# Altium project Mainboard_Jordan.PrjPcb
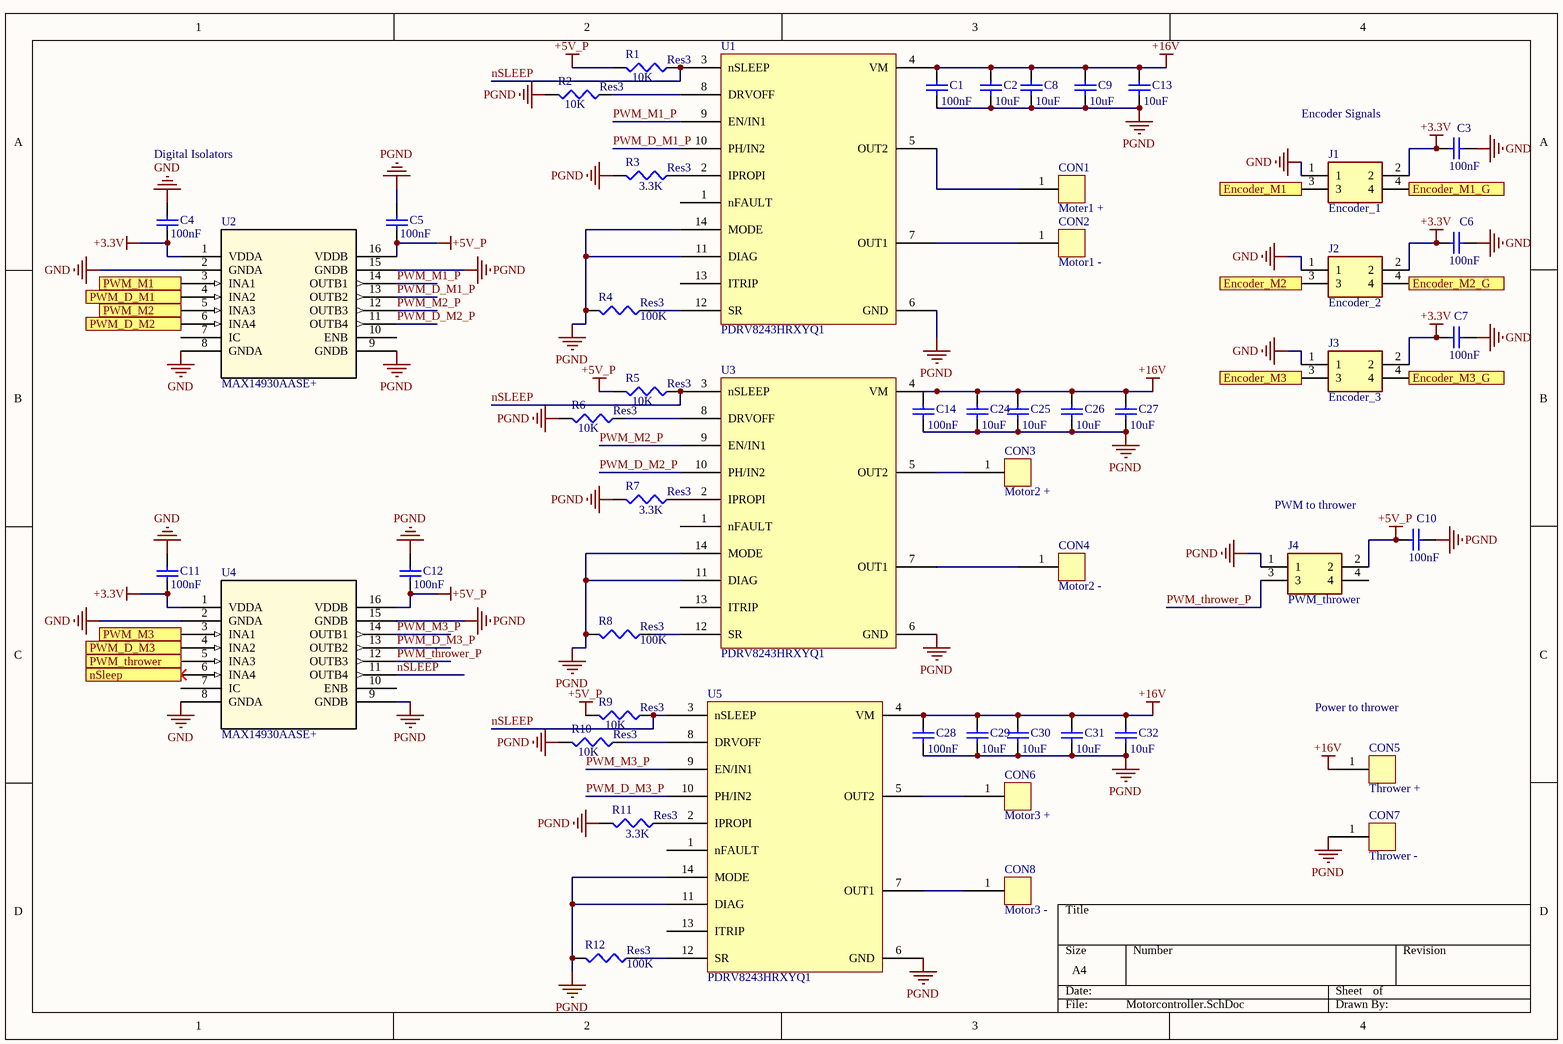
[diagram p0: Motorcontroller.SchDoc]
2 sheets, 82 parts. Net scope: flat (ports and power ports of the same name join across sheets).
Board file: PCB1.PcbDoc
Sheets:
  Motorcontroller.SchDoc
  Mainboard.SchDoc

## Sheet Motorcontroller.SchDoc
size A4; SheetNumber: 1; SheetTotal: 2

### Parts
C1  value 100nF  [1608[0603]]  (hidden comment: Cap Semi)
C2  value 10uF  [C1206]  (hidden comment: Cap Semi)
C3  value 100nF  [1608[0603]]  (hidden comment: Cap Semi)
C4  value 100nF  [1608[0603]]  (hidden comment: Cap Semi)
C5  value 100nF  [1608[0603]]  (hidden comment: Cap Semi)
C6  value 100nF  [1608[0603]]  (hidden comment: Cap Semi)
C7  value 100nF  [1608[0603]]  (hidden comment: Cap Semi)
C8  value 10uF  [C1206]  (hidden comment: Cap Semi)
C9  value 10uF  [C1206]  (hidden comment: Cap Semi)
C10  value 100nF  [1608[0603]]  (hidden comment: Cap Semi)
C11  value 100nF  [1608[0603]]  (hidden comment: Cap Semi)
C12  value 100nF  [1608[0603]]  (hidden comment: Cap Semi)
C13  value 10uF  [C1206]  (hidden comment: Cap Semi)
C14  value 100nF  [1608[0603]]  (hidden comment: Cap Semi)
C24  value 10uF  [C1206]  (hidden comment: Cap Semi)
C25  value 10uF  [C1206]  (hidden comment: Cap Semi)
C26  value 10uF  [C1206]  (hidden comment: Cap Semi)
C27  value 10uF  [C1206]  (hidden comment: Cap Semi)
C28  value 100nF  [1608[0603]]  (hidden comment: Cap Semi)
C29  value 10uF  [C1206]  (hidden comment: Cap Semi)
C30  value 10uF  [C1206]  (hidden comment: Cap Semi)
C31  value 10uF  [C1206]  (hidden comment: Cap Semi)
C32  value 10uF  [C1206]  (hidden comment: Cap Semi)
CON1  Moter1 +  [con_soldering]
CON2  Motor1 -  [con_soldering]
CON3  Motor2 +  [con_soldering]
CON4  Motor2 -  [con_soldering]
CON5  Thrower +  [con_soldering]
CON6  Motor3 +  [con_soldering]
CON7  Thrower -  [con_soldering]
CON8  Motor3 -  [con_soldering]
J1  Encoder_1  [TE_7-215079-4]
J2  Encoder_2  [TE_7-215079-4]
J3  Encoder_3  [TE_7-215079-4]
J4  PWM_thrower  [TE_7-215079-4]
R1  Res3  value 10K  [J1-0603]
R2  Res3  value 10K  [J1-0603]
R3  Res3  value 3.3K  [J1-0603]
R4  Res3  value 100K  [J1-0603]
R5  Res3  value 10K  [J1-0603]
R6  Res3  value 10K  [J1-0603]
R7  Res3  value 3.3K  [J1-0603]
R8  Res3  value 100K  [J1-0603]
R9  Res3  value 10K  [J1-0603]
R10  Res3  value 10K  [J1-0603]
R11  Res3  value 3.3K  [J1-0603]
R12  Res3  value 100K  [J1-0603]
U1  PDRV8243HRXYQ1  [DRV8243_motor_driver]
U2  MAX14930AASE+  [21-0041_S16+1_MXM]
U3  PDRV8243HRXYQ1  [DRV8243_motor_driver]
U4  MAX14930AASE+  [21-0041_S16+1_MXM]
U5  PDRV8243HRXYQ1  [DRV8243_motor_driver]

### Ports
Encoder_M1 (out), Encoder_M1_G (out), Encoder_M2 (out), Encoder_M2_G (out), Encoder_M3 (out), Encoder_M3_G (out), nSleep (in), PWM_D_M1 (in), PWM_D_M2 (in), PWM_D_M3 (in), PWM_M1 (in), PWM_M2 (in), PWM_M3 (in), PWM_thrower (in)

### Nets
+3.3V: C3.2 C4.2 C6.2 C7.2 C11.2 J1.2 J2.2 J3.2 U2.1(VDDA) U4.1(VDDA)
+5V_P: C5.2 C10.2 C12.2 J4.2 R1.2 R5.2 R9.2 U2.16(VDDB) U4.16(VDDB)
+16V: C1.2 C2.2 C8.2 C9.2 C13.2 C14.2 C24.2 C25.2 C26.2 C27.2 C28.2 C29.2 C30.2 C31.2 C32.2 CON5.1 U1.4(VM) U3.4(VM) U5.4(VM)
GND: C3.1 C4.1 C6.1 C7.1 C11.1 J1.1 J2.1 J3.1 U2.2(GNDA) U2.8(GNDA) U4.2(GNDA) U4.8(GNDA)
PGND: C1.1 C2.1 C5.1 C8.1 C9.1 C10.1 C12.1 C13.1 C14.1 C24.1 C25.1 C26.1 C27.1 C28.1 C29.1 C30.1 C31.1 C32.1 CON7.1 J4.1 R2.2 R3.2 R4.2 R6.2 R7.2 R8.2 R10.2 R11.2 R12.2 U1.6(GND) U1.11(DIAG) U1.14(MODE) U2.9(GNDB) U2.15(GNDB) U3.6(GND) U3.11(DIAG) U3.14(MODE) U4.9(GNDB) U4.15(GNDB) U5.6(GND) U5.11(DIAG) U5.14(MODE)
nSLEEP: R1.1 R5.1 R9.1 U1.3(nSLEEP) U3.3(nSLEEP) U4.11(OUTB4) U5.3(nSLEEP)
PWM_D_M1_P: U1.10(PH/IN2) U2.13(OUTB2)
PWM_D_M2_P: U2.11(OUTB4) U3.10(PH/IN2)
PWM_D_M3_P: U4.13(OUTB2) U5.10(PH/IN2)
PWM_M1_P: U1.9(EN/IN1) U2.14(OUTB1)
PWM_M2_P: U2.12(OUTB3) U3.9(EN/IN1)
PWM_M3_P: U4.14(OUTB1) U5.9(EN/IN1)
PWM_thrower_P: J4.3 U4.12(OUTB3)
NetCON1_1: CON1.1 U1.5(OUT2)
NetCON2_1: CON2.1 U1.7(OUT1)
NetCON3_1: CON3.1 U3.5(OUT2)
NetCON4_1: CON4.1 U3.7(OUT1)
NetCON6_1: CON6.1 U5.5(OUT2)
NetCON8_1: CON8.1 U5.7(OUT1)
NetJ1_3: J1.3 ; port Encoder_M1
NetJ1_4: J1.4 ; port Encoder_M1_G
NetJ2_3: J2.3 ; port Encoder_M2
NetJ2_4: J2.4 ; port Encoder_M2_G
NetJ3_3: J3.3 ; port Encoder_M3
NetJ3_4: J3.4 ; port Encoder_M3_G
NetR2_1: R2.1 U1.8(DRVOFF)
NetR3_1: R3.1 U1.2(IPROPI)
NetR4_1: R4.1 U1.12(SR)
NetR6_1: R6.1 U3.8(DRVOFF)
NetR7_1: R7.1 U3.2(IPROPI)
NetR8_1: R8.1 U3.12(SR)
NetR10_1: R10.1 U5.8(DRVOFF)
NetR11_1: R11.1 U5.2(IPROPI)
NetR12_1: R12.1 U5.12(SR)
NetU2_3: U2.3(INA1) ; port PWM_M1
NetU2_4: U2.4(INA2) ; port PWM_D_M1
NetU2_5: U2.5(INA3) ; port PWM_M2
NetU2_6: U2.6(INA4) ; port PWM_D_M2
NetU4_3: U4.3(INA1) ; port PWM_M3
NetU4_4: U4.4(INA2) ; port PWM_D_M3
NetU4_5: U4.5(INA3) ; port PWM_thrower
NetU4_6: U4.6(INA4) ; port nSleep

Not connected (* = marked no-connect by the designer): J4 4; U1 1(nFAULT) 13(ITRIP); U2 7(IC) 10(ENB); U3 1(nFAULT) 13(ITRIP); U4 7(IC) 10(ENB); U5 1(nFAULT) 13(ITRIP)

### Notes on the sheet
- Encoder Signals
- Digital Isolators
- PWM to thrower
- Power to thrower

### Library data of the parts
C1-C14 C24-C32 = Cap Semi: Capacitor (Semiconductor SIM Model)
CON1-CON8 = Con_soldering
J1-J4 = Con_4_encoder: Micro-MaTch 4 Position 1.27 mm Pitch Vertical Female-on-Board Connector; MP: 7-215079-4; MF: TE Connectivity
R1-R12 = Res3: Resistor; Published: 8-Jun-2000; LatestRevisionDate: 29-May-2009; LatestRevisionNote: IPC-7351 Footprint Added.; PackageReference: J1-0603; Publisher: Altium Limited; PackageDescription: Chip Resistor
U2 U4 = MAX14930AASE+: No Description Available; Mfr_Name: Maxim Integrated Products; Copyright: Copyright (C) 2021 Ultra Librarian. All rights reserved.; Manufacturer_Part_Number: MAX14930AASE+; RefDes: RefDes; Type: DEV

## Sheet Mainboard.SchDoc
size A4; SheetNumber: 2; SheetTotal: 2
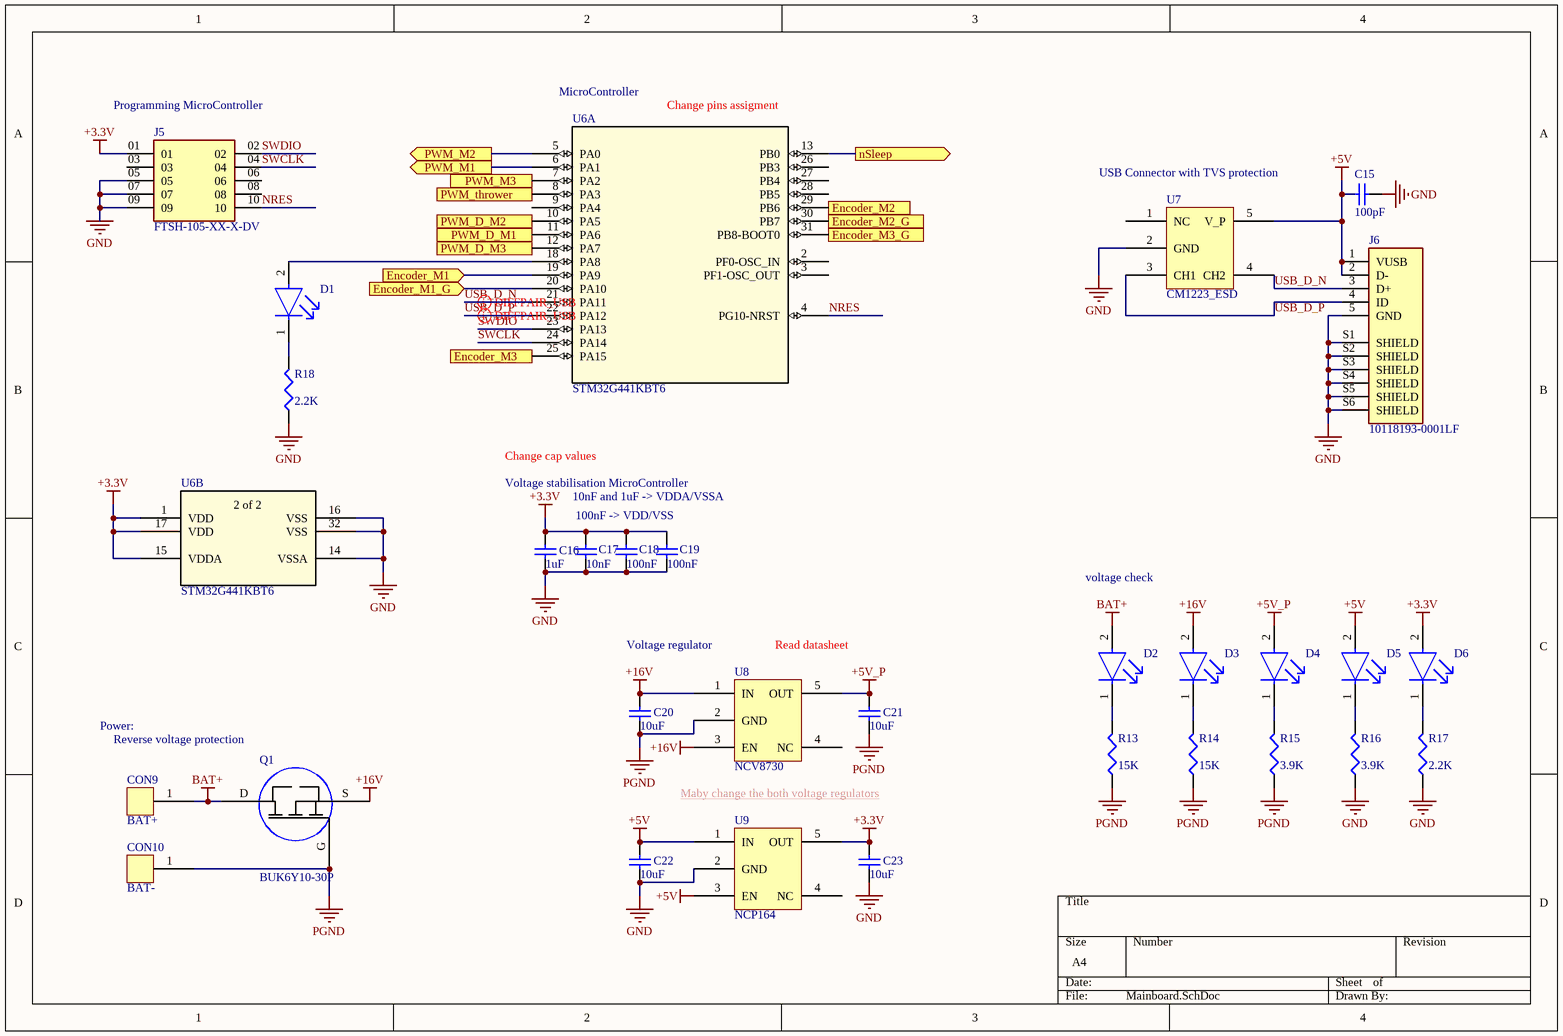
[diagram p1: Mainboard.SchDoc]

### Parts
C15  value 100pF  [1608[0603]]  (hidden comment: Cap Semi)
C16  value 1uF  [1608[0603]]  (hidden comment: Cap Semi)
C17  value 10nF  [1608[0603]]  (hidden comment: Cap Semi)
C18  value 100nF  [1608[0603]]  (hidden comment: Cap Semi)
C19  value 100nF  [1608[0603]]  (hidden comment: Cap Semi)
C20  value 10uF  [C1206]  (hidden comment: Cap Semi)
C21  value 10uF  [C1206]  (hidden comment: Cap Semi)
C22  value 10uF  [C1206]  (hidden comment: Cap Semi)
C23  value 10uF  [C1206]  (hidden comment: Cap Semi)
CON9  BAT+  [con_soldering]
CON10  BAT-  [con_soldering]
D1  LTST-C190GKT  [FP-LTST-C190GKT-MFG]  (value not drawn)
D2  LTST-C190GKT  [FP-LTST-C190GKT-MFG]  (value not drawn)
D3  LTST-C190GKT  [FP-LTST-C190GKT-MFG]  (value not drawn)
D4  LTST-C190GKT  [FP-LTST-C190GKT-MFG]  (value not drawn)
D5  LTST-C190GKT  [FP-LTST-C190GKT-MFG]  (value not drawn)
D6  LTST-C190GKT  [FP-LTST-C190GKT-MFG]  (value not drawn)
J5  FTSH-105-XX-X-DV  [SAMTEC_FTSH-105-XX-X-DV]
J6  10118193-0001LF  [FCI_10118193-0001LF]
Q1  BUK6Y10-30P  [TRANS_PSMN5R5-60YS,115]
R13  value 15K  [J1-0603]  (hidden comment: Res3)
R14  value 15K  [J1-0603]  (hidden comment: Res3)
R15  value 3.9K  [J1-0603]  (hidden comment: Res3)
R16  value 3.9K  [J1-0603]  (hidden comment: Res3)
R17  value 2.2K  [J1-0603]  (hidden comment: Res3)
R18  value 2.2K  [J1-0603]  (hidden comment: Res3)
U6  STM32G441KBT6  [LQFP-32]  (parts A,B of 2)
U7  CM1223_ESD  [CM1223_ESD]
U8  NCV8730  [NCP164CSN330T1G_Voltage_regulator]
U9  NCP164  [NCP164CSN330T1G_Voltage_regulator]

### Ports
Encoder_M1 (in), Encoder_M1_G (in), Encoder_M2 (in), Encoder_M2_G (in), Encoder_M3 (in), Encoder_M3_G (in), nSleep (out), PWM_D_M1 (out), PWM_D_M2 (out), PWM_D_M3 (out), PWM_M1 (out), PWM_M2 (out), PWM_M3 (out), PWM_thrower (out)

### Nets
+3.3V: C16.2 C17.2 C18.2 C19.2 C23.2 D6.2(A) J5.01 U6.1(VDD) U6.15(VDDA) U6.17(VDD) U9.5(OUT)
+5V: C15.2 C22.2 D5.2(A) J6.1(VUSB) J6.2(D-) U7.5(V_P) U9.1(IN) U9.3(EN)
+5V_P: C21.2 D4.2(A) U8.5(OUT)
+16V: C20.2 D3.2(A) Q1.S U8.1(IN) U8.3(EN)
BAT+: CON9.1 D2.2(A) Q1.D
GND: C15.1 C16.1 C17.1 C18.1 C19.1 C22.1 C23.1 J5.05 J5.07 J5.09 J6.5(GND) J6.S1(SHIELD) J6.S2(SHIELD) J6.S3(SHIELD) J6.S4(SHIELD) J6.S5(SHIELD) J6.S6(SHIELD) R16.1 R17.1 R18.1 U6.14(VSSA) U6.16(VSS) U6.32(VSS) U7.2(GND) U9.2(GND)
PGND: C20.1 C21.1 CON10.1 Q1.G R13.1 R14.1 R15.1 U8.2(GND)
NRES: J5.10 U6.4(PG10-NRST)
SWCLK: J5.04 U6.24(PA14)
SWDIO: J5.02 U6.23(PA13)
USB_D_N: J6.3(D+) U6.21(PA11) U7.4(CH2)
USB_D_P: J6.4(ID) U6.22(PA12) U7.3(CH1)
NetD1_1: D1.1(C) R18.2
NetD1_2: D1.2(A) U6.18(PA8)
NetD2_1: D2.1(C) R13.2
NetD3_1: D3.1(C) R14.2
NetD4_1: D4.1(C) R15.2
NetD5_1: D5.1(C) R16.2
NetD6_1: D6.1(C) R17.2
NetJ1_3: U6.19(PA9) ; port Encoder_M1
NetJ1_4: U6.20(PA10) ; port Encoder_M1_G
NetJ2_3: U6.29(PB6) ; port Encoder_M2
NetJ2_4: U6.30(PB7) ; port Encoder_M2_G
NetJ3_3: U6.25(PA15) ; port Encoder_M3
NetJ3_4: U6.31(PB8-BOOT0) ; port Encoder_M3_G
NetU2_3: U6.6(PA1) ; port PWM_M1
NetU2_4: U6.11(PA6) ; port PWM_D_M1
NetU2_5: U6.5(PA0) ; port PWM_M2
NetU2_6: U6.10(PA5) ; port PWM_D_M2
NetU4_3: U6.7(PA2) ; port PWM_M3
NetU4_4: U6.12(PA7) ; port PWM_D_M3
NetU4_5: U6.8(PA3) ; port PWM_thrower
NetU4_6: U6.13(PB0) ; port nSleep

Not connected (* = marked no-connect by the designer): J5 03 06 08; U6 2(PF0-OSC_IN) 3(PF1-OSC_OUT) 9(PA4) 26(PB3) 27(PB4) 28(PB5); U7 1(NC); U8 4(NC); U9 4(NC)

### Layout directives
differential pair; differential pair class diff_USB: USB_D_N, USB_D_P

### Notes on the sheet
- (near J5) Programming MicroController
- MicroController
- (near U6) Change pins assigment
- USB Connector with TVS protection
- Voltage stabilisation MicroController
- Change cap values
- 10nF and 1uF -> VDDA/VSSA
- 100nF -> VDD/VSS
- voltage check
- Voltage regulator
- Read datasheet
- Power:
- Reverse voltage protection
- Maby change the both voltage regulators
- (in symbol STM32G441KBT6, part B) 2 of 2

### Library data of the parts
C15-C23 = Cap Semi: Capacitor (Semiconductor SIM Model)
CON9 CON10 = Con_soldering
D1-D6 = CMP-22017-000005-2: LED GREEN CLEAR CHIP SMD; Dominant Wavelength: 569nm; Reverse Voltage: 5V; Lens Color: Colorless; Viewing Angle: 130°; Voltage: 2V; Forward Current: 30mA; Power Dissipation: 100mW; Luminous Intensity: 6mcd; Number of LEDs: 1; Forward Voltage: 2.1V; Wavelength: 565nm; Test Current: 10mA
J5 = FTSH-105-XX-X-DV: Connector Header Surface Mount 10 position 0.050" (1.27mm)
J6 = 10118193-0001LF: USB - micro B USB 2.0 Receptacle Connector 5 Position Surface Mount, Right Angle; Through Hole; MF: Amphenol ICC
R13-R18 = Res3: Resistor
U6 = STM32G441KBT6: No Description Available; Mfr_Name: STMicroelectronics

## Nets that join several sheets
+3.3V: Motorcontroller (10 pins), Mainboard (11 pins)
+5V_P: Motorcontroller (9 pins), Mainboard (C21.2 D4.2 U8.5)
+16V: Motorcontroller (19 pins), Mainboard (5 pins)
GND: Motorcontroller (12 pins), Mainboard (25 pins)
PGND: Motorcontroller (42 pins), Mainboard (8 pins)
NetJ1_3: Motorcontroller (J1.3), Mainboard (U6.19)
NetJ1_4: Motorcontroller (J1.4), Mainboard (U6.20)
NetJ2_3: Motorcontroller (J2.3), Mainboard (U6.29)
NetJ2_4: Motorcontroller (J2.4), Mainboard (U6.30)
NetJ3_3: Motorcontroller (J3.3), Mainboard (U6.25)
NetJ3_4: Motorcontroller (J3.4), Mainboard (U6.31)
NetU2_3: Motorcontroller (U2.3), Mainboard (U6.6)
NetU2_4: Motorcontroller (U2.4), Mainboard (U6.11)
NetU2_5: Motorcontroller (U2.5), Mainboard (U6.5)
NetU2_6: Motorcontroller (U2.6), Mainboard (U6.10)
NetU4_3: Motorcontroller (U4.3), Mainboard (U6.7)
NetU4_4: Motorcontroller (U4.4), Mainboard (U6.12)
NetU4_5: Motorcontroller (U4.5), Mainboard (U6.8)
NetU4_6: Motorcontroller (U4.6), Mainboard (U6.13)